# Altium schematic sheet VIA_MOTORS.SchDoc
size A; Organization: Altium Limited; Address1: L3, 12a Rodborough Rd; Address2: Frenchs Forest; Address3: NSW; Address4: Australia 2086; SheetNumber: 1; SheetTotal: 2
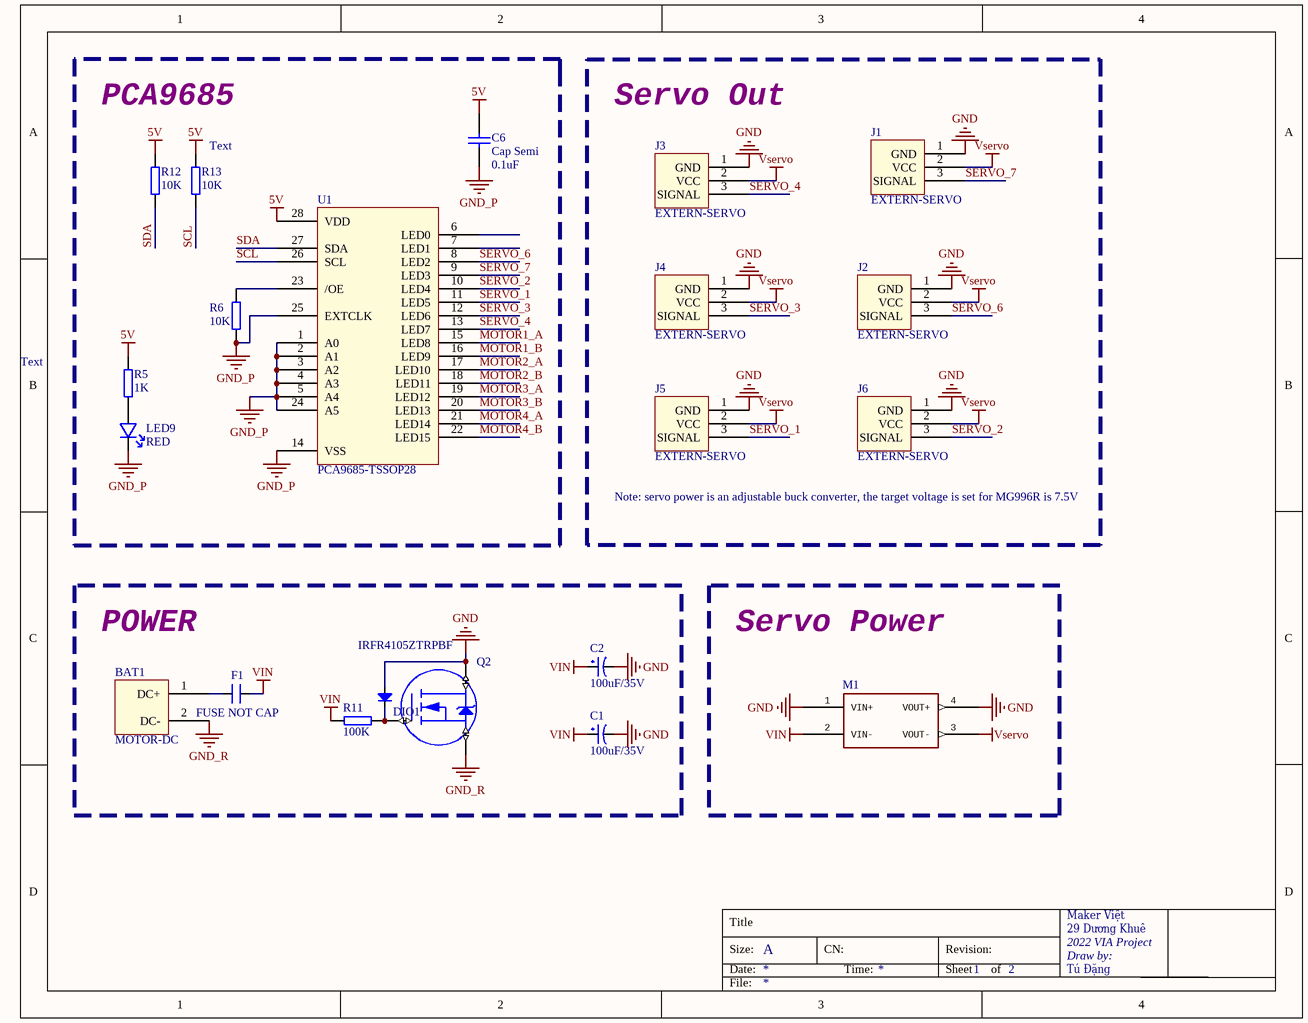
[diagram p0: VIA_MOTORS.SchDoc]

## Parts
BAT1  MOTOR-DC  [CON2-5.08DC]
C1  100uF/35V  [CP1.5/3.4]
C2  100uF/35V  [CP1.5/3.4]
C6  Cap Semi  value 0.1uF  [SMT0603]
DIO1  Diode SMD  [DIO-SMD-123]  (value not drawn)
F1  FUSE NOT CAP  [CN2]
J1  EXTERN-SERVO  [JP3H]
J2  EXTERN-SERVO  [JP3H]
J3  EXTERN-SERVO  [JP3H]
J4  EXTERN-SERVO  [JP3H]
J5  EXTERN-SERVO  [JP3H]
J6  EXTERN-SERVO  [JP3H]
LED9  RED  [SMT0603P]
M1  MP1584-dc-brick-pcb Step down Input: 4.5V - 28V Ouput 0.8V - 25V max. 3A Cheap on ebay  [MP1584 MODULE - duplicate]  (value not drawn)
Q2  IRFR4105ZTRPBF  [TO252-3]
R5  value 1K  [SMT0603]  (hidden comment: Resistor)
R6  value 10K  [SMT0603]  (hidden comment: Resistor)
R11  value 100K  [SMT0603]  (hidden comment: Resistor)
R12  value 10K  [SMT0603]  (hidden comment: Resistor)
R13  value 10K  [SMT0603]  (hidden comment: Resistor)
U1  PCA9685-TSSOP28  [TSSOP28-SMD]

## Blocks framed on the sheet
Servo Out: J1-J6
POWER: BAT1 C1 C2 DIO1 F1 Q2 R11
Servo Power: M1

## Nets
5V: C6.2 R5.2 R12.2 R13.2 U1.28(VDD)
GND: C1.2 C2.2 DIO1.1(A) J1.1(GND) J2.1(GND) J3.1(GND) J4.1(GND) J5.1(GND) J6.1(GND) M1.1(VIN+) M1.4(VOUT+) Q2.2(D@1)
GND_P: C6.1 LED9.2 R6.1 U1.1(A0) U1.2(A1) U1.3(A2) U1.4(A3) U1.5(A4) U1.14(VSS) U1.24(A5) U1.25(EXTCLK)
GND_R: BAT1.2(DC-) Q2.3(S)
VIN: C1.1 C2.1 F1.2 M1.2(VIN-) R11.2
Vservo: J1.2(VCC) J2.2(VCC) J3.2(VCC) J4.2(VCC) J5.2(VCC) J6.2(VCC) M1.3(VOUT-)
MOTOR1_A: U1.15(LED8)
MOTOR1_B: U1.16(LED9)
MOTOR2_A: U1.17(LED10)
MOTOR2_B: U1.18(LED11)
MOTOR3_A: U1.19(LED12)
MOTOR3_B: U1.20(LED13)
MOTOR4_A: U1.21(LED14)
MOTOR4_B: U1.22(LED15)
SCL: R13.1 U1.26(SCL)
SDA: R12.1 U1.27(SDA)
SERVO_1: J5.3(SIGNAL) U1.11(LED5)
SERVO_2: J6.3(SIGNAL) U1.10(LED4)
SERVO_3: J4.3(SIGNAL) U1.12(LED6)
SERVO_4: J3.3(SIGNAL) U1.13(LED7)
SERVO_6: J2.3(SIGNAL) U1.8(LED2)
SERVO_7: J1.3(SIGNAL) U1.9(LED3)
NetBAT1_1: BAT1.1(DC+) F1.1
NetDIO1_2: DIO1.2(K) Q2.1(G) R11.1
NetLED9_1: LED9.1 R5.1
NetR6_2: R6.2 U1.23(/OE)

Not connected (* = marked no-connect by the designer): Q2 PAD(D@2); U1 6(LED0) 7(LED1)

## Notes on the sheet
- PCA9685
- (near R13) Text
- Text
- Note: servo power is an adjustable buck converter, the target voltage is set for MG996R is 7.5V
- Title
- Size:
- Date:
- A
- CN:
- Time:
- Revision:
- Sheet
- of
- Maker Việt
- 29 Dương Khuê
- 2022 VIA Project
- Draw by:
- Tú Đặng
- File:

## Library data of the parts
C1 C2 = CP3: Cap 100uF/35V - 470uF/16V; Value: 100uF/35V/50V; Description 1: 1000uF/6,3V - 470uF/16V - 330uF - 25V; Description 2: 220uF/35V - 100uF/50V - 63V - 4,7uF/200V; Description 3: 22uF => 33uF100V - 3,3uF => 4,7uF/250V; Description 4: 2,2uF =>3,3uF/350 - 2,2uF/400V - 1uF/450V
C6 = CAP-SM-0603-X7R-1uF: CAP SM 0603 X7R 1uF 10%; Tolerance: ±10%; Supplier 1: Digi-Key; Supplier 2: Farnell; Supplier Part Number 1: 490-5307-1-ND; Supplier Part Number 2: 2366834
DIO1 = Diode SMD: Default Diode; Code - JEDEC: DO-214-AB; Value: 1N5007; Published: 8-Jun-2000; Revision: July-2002: Re-released for DXP Platform.; Publisher: Altium Limited
F1 = CN2: Cap np 104 => 105pF; Value: 0.1uF
LED9 = LNJ237W82RA: LED SM 0603 RED 1V95 FWD VOLTAGE; Supplier 1: Digi-Key; Forward Voltage: 1V95; Supplier Part Number 1: LNJ237W82RACT-ND
M1 = MP1584
Q2 = IRFR4105ZTRPBF: RoHS Compliant | Industry-leading quality | Fast Switching | 175C Operating Temperature; MF: Infineon Technologies; MP: IRFR4105ZTRPBF; Check_prices: https://www.snapeda.com/parts/IRFR4105ZTRPBF/Infineon%20Technologies/view-part/821491/?ref=eda; Digi-Key_Part_Number: IRFR4105ZTRPBFCT-ND; Package: TO-252 International Rectifier; Purchase-URL: https://pricing.snapeda.com/search/part/IRFR4105ZTRPBF/?ref=eda; Value: *; SnapEDA_Link: https://www.snapeda.com/parts/IRFR4105ZTRPBF/Infineon%20Technologies/view-part/821491/?ref=snap
R5 = RES-SM-0603-1K: RES SM 0603 1K
R6 R12 R13 = RES-SM-0603-10K: RES SM 0603 10K; Supplier 1: Farnell; Supplier 2: Digi-Key; Supplier Part Number 1: 9330399; Supplier Part Number 2: 541-10.0KHCT-ND
R11 = RES-SM-0603-100K: RES SM 0603 100K; Supplier 1: Farnell; Supplier 2: Digi-Key; Supplier Part Number 1: 1344361; Supplier Part Number 2: 541-100KHCT-ND